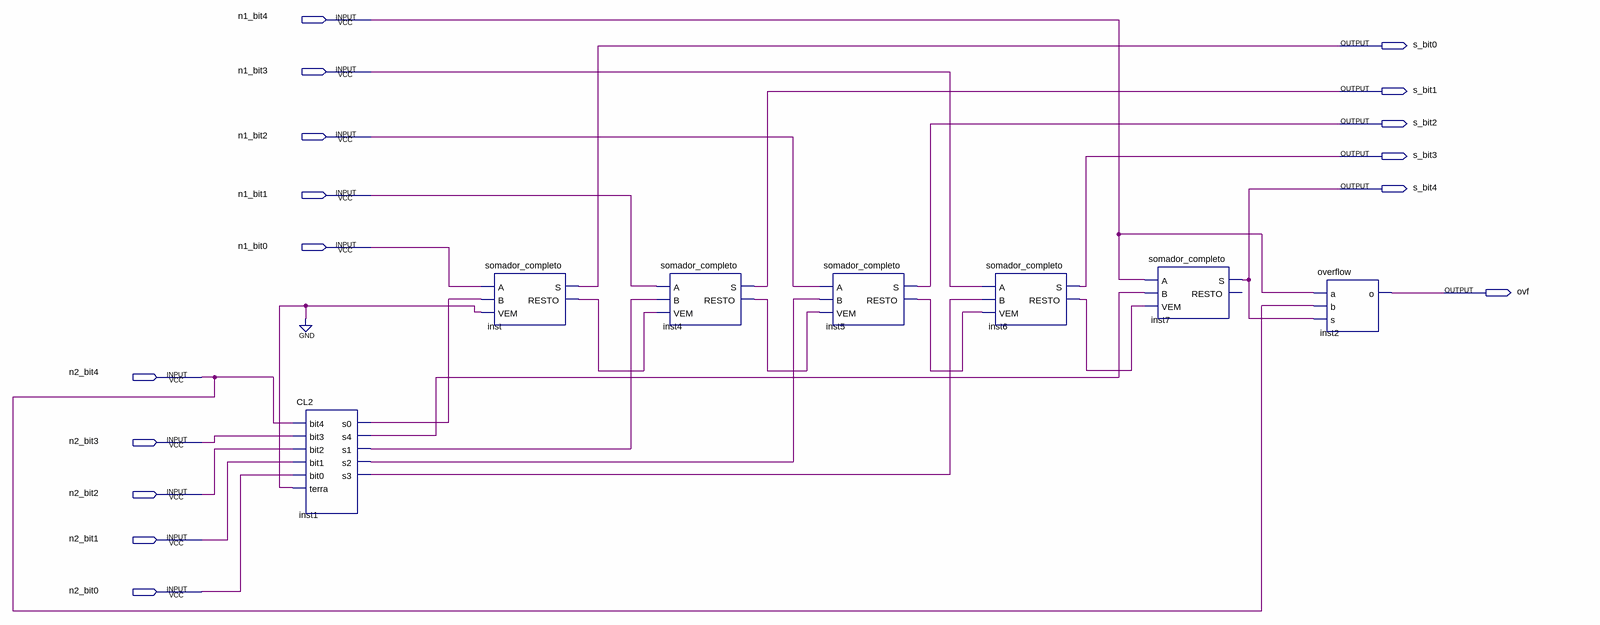
[diagram p0: schematic sheet]
// Quartus schematic subtrator.bdf as structural Verilog: 7 symbols, 16 pins
module subtrator (
  input  n1_bit4,
  input  n1_bit3,
  input  n1_bit2,
  input  n1_bit1,
  input  n1_bit0,
  input  n2_bit4,
  input  n2_bit3,
  input  n2_bit2,
  input  n2_bit1,
  input  n2_bit0,
  output s_bit0,
  output s_bit1,
  output s_bit2,
  output s_bit3,
  output s_bit4,
  output ovf
);

  wire inst1_s0, inst1_s1, inst1_s2, inst1_s3, inst1_s4, inst4_resto, inst5_resto, inst6_resto, inst_resto;

  CL2 inst1 (
    .bit4(n2_bit4), .bit3(n2_bit3), .bit2(n2_bit2), .bit1(n2_bit1), .bit0(n2_bit0), .terra(1'b0),
    .s0(inst1_s0), .s4(inst1_s4), .s1(inst1_s1), .s2(inst1_s2), .s3(inst1_s3));
  somador_completo inst (.A(n1_bit0), .B(inst1_s0), .VEM(1'b0), .S(s_bit0), .RESTO(inst_resto));
  somador_completo inst4 (.A(n1_bit1), .B(inst1_s1), .VEM(inst_resto), .S(s_bit1), .RESTO(inst4_resto));
  somador_completo inst5 (.A(n1_bit2), .B(inst1_s2), .VEM(inst4_resto), .S(s_bit2), .RESTO(inst5_resto));
  somador_completo inst6 (.A(n1_bit3), .B(inst1_s3), .VEM(inst5_resto), .S(s_bit3), .RESTO(inst6_resto));
  somador_completo inst7 (.A(n1_bit4), .B(inst1_s4), .VEM(inst6_resto), .S(s_bit4));  // open: RESTO
  overflow inst2 (.a(n1_bit4), .b(n2_bit4), .s(s_bit4), .o(ovf));
endmodule
